# EAGLE design Hot_tub_PoE_RS485_Arduino (EAGLE 6.4)
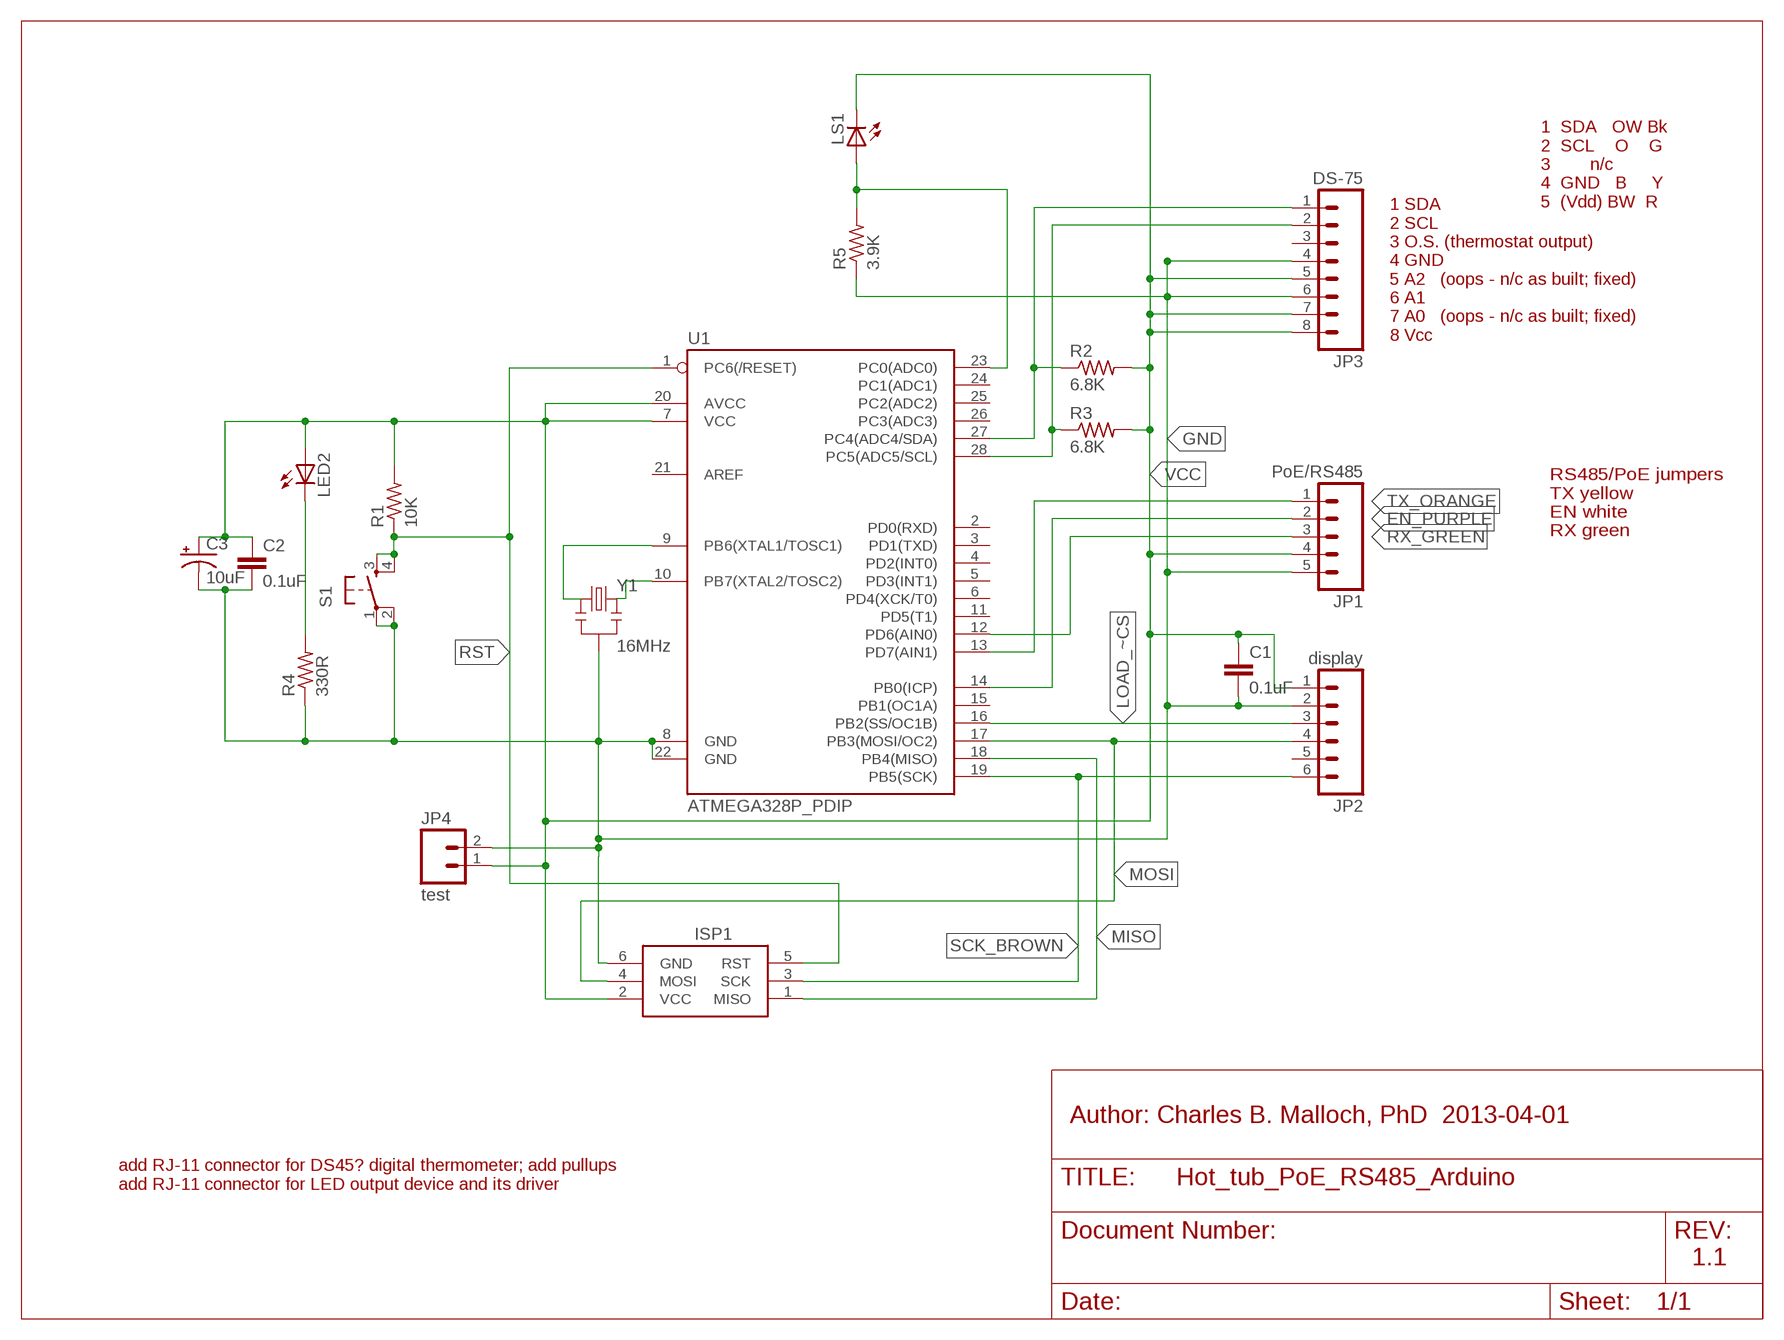
[diagram p0: schematic, sheet 1]

## Parts
C1  0.1uF  CAPPTH  [CAP-PTH-SMALL]
C2  0.1uF  CAPPTH  [CAP-PTH-SMALL]
C3  10uF  CAP_POLPTH2  [CPOL-RADIAL-10UF-25V]
ISP1  AVRISP-6  [AVRISP]
JP1  PoE/RS485  M05LOCK_LONGPADS  [1X05_LOCK_LONGPADS]
JP2  display  M06LOCK_LONGPADS  [1X06_LOCK_LONGPADS]
JP3  DS-75  M08LOCK_LONGPADS  [1X08_LOCK_LONGPADS]
JP4  test  M02LOCK_LONGPADS  [1X02_LOCK_LONGPADS]
LED2  LED5MM  [LED5MM]
LS1  LED5MM  [LED5MM]
R1  10K  R-US_0204/5  [0204/5]
R2  6.8K  R-US_0207/10  [0207/10]
R3  6.8K  R-US_0207/10  [0207/10]
R4  330R  R-US_0207/10  [0207/10]
R5  3.9K  R-US_0207/10  [0207/10]
S1  TAC_SWITCHPTH  [TACTILE-PTH]
U1  ATMEGA328P_PDIP  [DIL28-3]
Y1  16MHz  RESONATORPTH  [RESONATOR-PTH]

## Nets
EN_PURPLE: JP1.2 U1.14(PB0(ICP))
GND: C1.2 C2.2 C3.2(-) ISP1.6(GND) JP1.5 JP2.2 JP3.4 JP3.6 JP4.2 R4.1 R5.1 S1.1 S1.2 U1.8(GND) U1.22(GND) Y1.2
LOAD_~CS: JP2.3 U1.16(PB2(SS/OC1B))
MISO: ISP1.1(MISO) U1.18(PB4(MISO))
MOSI: ISP1.4(MOSI) JP2.4 U1.17(PB3(MOSI/OC2))
N$1: JP3.1 R2.1 U1.27(PC4(ADC4/SDA))
N$2: LED2.K(C) R4.2
N$3: LS1.A R5.2 U1.23(PC0(ADC0))
N$5: U1.10(PB7(XTAL2/TOSC2)) Y1.3
N$6: JP3.2 R3.1 U1.28(PC5(ADC5/SCL))
N$7: U1.9(PB6(XTAL1/TOSC1)) Y1.1
RST: ISP1.5(RST) R1.1 S1.3 S1.4 U1.1(PC6(/RESET))
RX_GREEN: JP1.3 U1.12(PD6(AIN0))
SCK_BROWN: ISP1.3(SCK) JP2.6 U1.19(PB5(SCK))
TX_ORANGE: JP1.1 U1.13(PD7(AIN1))
VCC: C1.1 C2.1 C3.1(+) ISP1.2(VCC) JP1.4 JP2.1 JP3.5 JP3.7 JP3.8 JP4.1 LED2.A LS1.K(C) R1.2 R2.2 R3.2 U1.7(VCC) U1.20(AVCC)
Unconnected: JP2.5 JP3.3 U1.2(PD0(RXD)) U1.3(PD1(TXD)) U1.4(PD2(INT0)) U1.5(PD3(INT1)) U1.6(PD4(XCK/T0)) U1.11(PD5(T1)) U1.15(PB1(OC1A)) U1.21(AREF) U1.24(PC1(ADC1)) U1.25(PC2(ADC2)) U1.26(PC3(ADC3))

## Notes on the sheet
- 1  SDA   OW Bk
  2  SCL    O    G
  3        n/c
  4  GND   B     Y
  5  (Vdd) BW  R
- 1 SDA
  2 SCL
  3 O.S. (thermostat output)
  4 GND
  5 A2   (oops - n/c as built; fixed)
  6 A1
  7 A0   (oops - n/c as built; fixed)
  8 Vcc
- RS485/PoE jumpers
  TX yellow
  EN white
  RX green
- Author: Charles B. Malloch, PhD  2013-04-01
- add RJ-11 connector for DS45? digital thermometer; add pullups
  add RJ-11 connector for LED output device and its driver
- 1.1

## Library data of the parts
C1 C2 = SparkFun-Passives:CAP: Capacitor Standard 0603 ceramic capacitor, and 0.1" leaded capacitor.
C3 = SparkFun-Passives:CAP_POL: Capacitor Polarized These are standard SMD and PTH capacitors. Normally 10uF, 47uF, and 100uF in electrolytic and tantalum varieties. Always verify the external diameter of the through hole cap, it varies with capacity, voltage, and manufacturer. The EIA devices should be standard.
ISP1 = adafruit:AVRISP: AVR ISP HEADER Standard 6 pin header for AVR programming
JP1 = SparkFun-Connectors:M05: Header 5 Standard 5-pin 0.1" header. Use with straight break away headers (SKU : PRT-00116), right angle break away headers (PRT-00553), swiss pins (PRT-00743), machine pins (PRT-00117), and female headers (PRT-00115). Molex polarized connector foot print use with SKU : PRT-08230 with associated crimp pins and housings.
JP2 = SparkFun-Connectors:M06: Header 6 Standard 6-pin 0.1" header. Use with straight break away headers (SKU : PRT-00116), right angle break away headers (PRT-00553), swiss pins (PRT-00743), machine pins (PRT-00117), and female headers (PRT-00115). Molex polarized connector foot print use with SKU : PRT-08094 with associated crimp pins and housings. NOTES ON THE VARIANTS LOCK and LOCK_LONGPADS... This footprint was designed to help hold the alignment of a through-hole component (i.e. 6-pin header) while soldering it into place. You may notice that each hole has been shifted either up or down by 0.005 of an inch from it's more standard position (which is a perfectly straight line). This slight alteration caused the pins (the squares in the middle) to touch the edges of the holes. Because they are alternating, it causes a "brace" to hold the component in place. 0.005 has proven to be the perfect amount of "off-center" position when using our standard breakaway headers. Although looks a little odd when you look at the bare footprint, once you have a header in there, the alteration is very hard to notice. Also, if you push a header all the way into place, it is covered up entirely on the bottom side. This idea of altering the position of holes to aid alignment will be further integrated into the Sparkfun Library for other footprints. It can help hold any component with 3 or more connection pins.
JP3 = SparkFun-Connectors:M08: Header 8 Standard 8-pin 0.1" header. Use with straight break away headers (SKU : PRT-00116), right angle break away headers (PRT-00553), swiss pins (PRT-00743), machine pins (PRT-00117), and female headers (PRT-00115).
JP4 = SparkFun-Connectors:M02: Header 2 Standard 2-pin 0.1" header. Use with straight break away headers (SKU : PRT-00116), right angle break away headers (PRT-00553), swiss pins (PRT-00743), machine pins (PRT-00117), and female headers (PRT-00115). Molex polarized connector foot print use with SKU : PRT-08233 with associated crimp pins and housings.
LED2 LS1 = SparkFun-LED:LED: LEDs Standard schematic elements and footprints for 5mm, 3mm, 1206, and 0603 sized LEDs. 5mm - Spark Fun Electronics SKU : COM-00529 (and others)
R1 = adafruit:R-US_: RESISTOR, American symbol
R2-R5 = resistor:R-US_: RESISTOR, American symbol
S1 = SparkFun-Electromechanical:TAC_SWITCH: Momentary Switch Button commonly used for reset or general input. Spark Fun Electronics SKU : COM-00097 SMT- SWCH-08247
U1 = SparkFun-DigitalIC:ATMEGA328P_PDIP: uC used in the Arduino 32kb flash, 1k EEPROM, 2k SRAM This is the through-hole version of this chip.
Y1 = SparkFun-FreqCtrl:RESONATOR: Resonator Small SMD resonator. Used, eg, on the Arduino Pro/ Pro Mini boards. 8MHz- XTAL-08895 16MHz- XTAL-08900

## Board
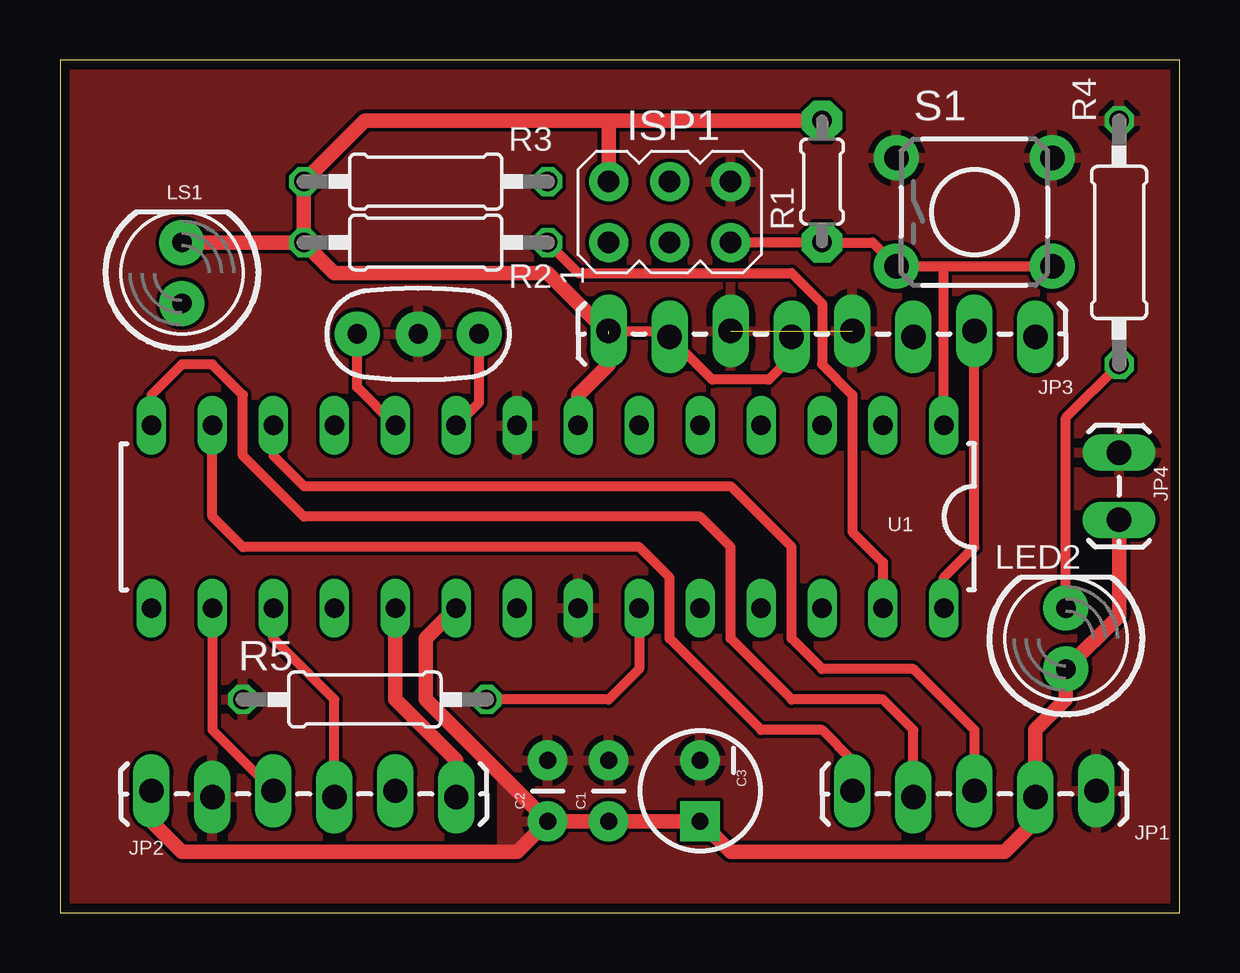
[diagram p1: board, top side]
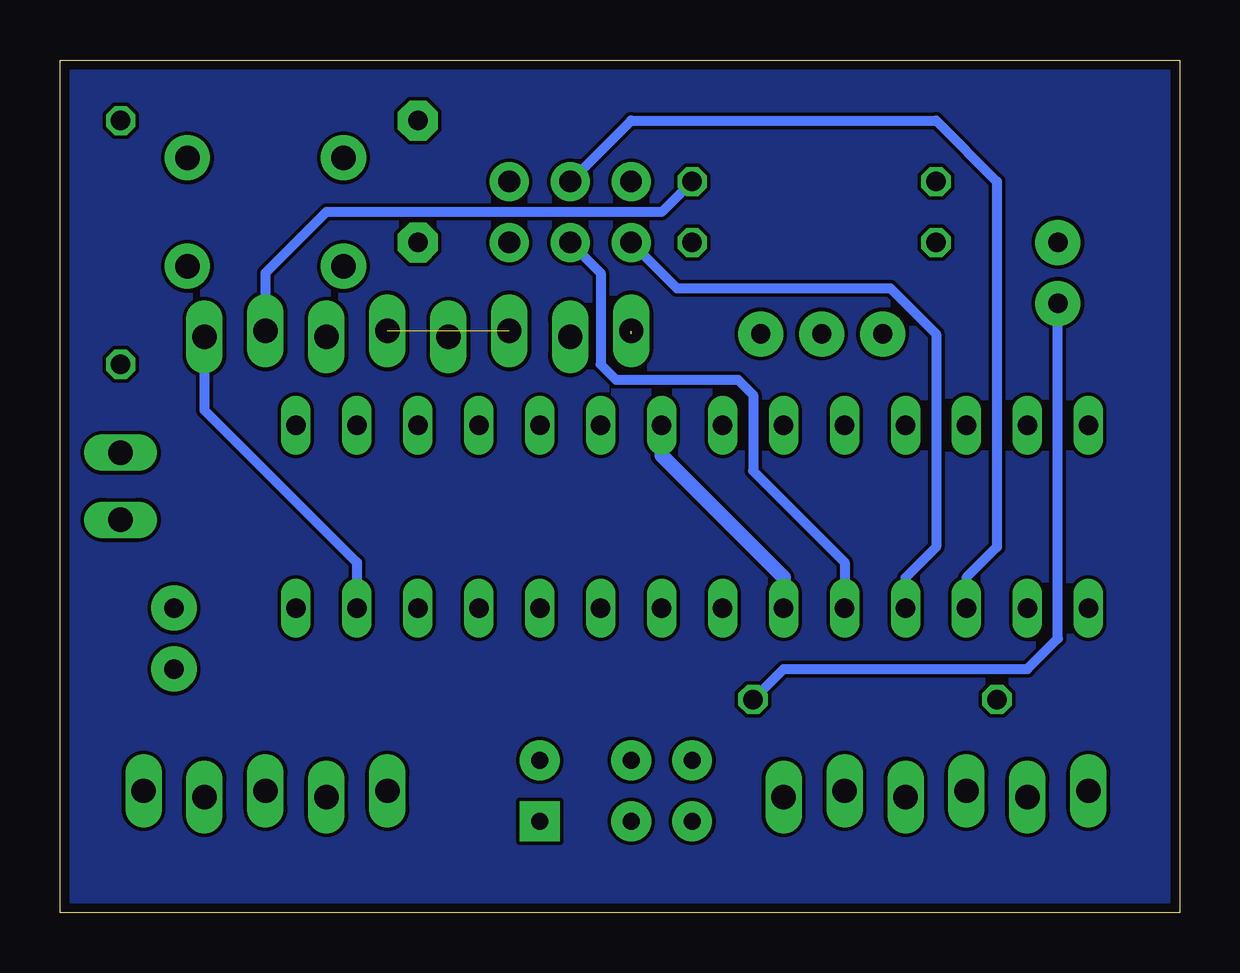
[diagram p2: board, bottom side, seen from below]

Size 46.66 x 35.55 mm. Coordinates in mm from the lower left corner, seen from the top.
Outline: 0,0 46.66,0 46.66,35.55 0,35.55 0,0
Copper layers (1*16): Top 0.0356mm / dielectric 1.5011mm / Bottom 0.0356mm
Design rules "LaenPCBOrder": minimum track width 6mil, minimum drill 13mil, track to track 6mil, track to pad 6mil, pad to pad 6mil, via to via 6mil, smd to smd 6mil, copper to edge 15mil, drill to drill 6mil, minimum pad ring 7mil, minimum via ring 7mil, stop-mask expansion 4mil, vias tented up to drill 0mil, thermal gap 10mil

### Footprints (pad centres in the part's own frame; a part is rotated, then mirrored left to right if it is on the bottom)
CAP-PTH-SMALL = drill 0.7 pad 1.651: 1 0,0; 2 2.54,0
CPOL-RADIAL-10UF-25V = drill 0.7 pad 1.651 square: 1 1.27,0 | drill 0.7 pad 1.651: 2 -1.27,0
AVRISP = drill 0.9 pad 1.626: 1 -1.27,2.54; 2 1.27,2.54; 3 -1.27,0; 4 1.27,0; 5 -1.27,-2.54; 6 1.27,-2.54
1X05_LOCK_LONGPADS = drill 1.016 long: 1 0,0; 2 2.54,-0.254; 3 5.08,0; 4 7.62,-0.254; 5 10.16,0
1X06_LOCK_LONGPADS = drill 1.016 long: 1 0,0; 2 2.54,-0.254; 3 5.08,0; 4 7.62,-0.254; 5 10.16,0; 6 12.7,-0.254
1X08_LOCK_LONGPADS = drill 1.016 long: 1 0,0.127; 2 2.54,-0.127; 3 5.08,0.127; 4 7.62,-0.127; 5 10.16,0.127; 6 12.7,-0.127; 7 15.24,0.127; 8 17.78,-0.127
1X02_LOCK_LONGPADS = drill 1.016 long: 1 -0.127,0; 2 2.667,0
LED5MM = drill 0.813 pad 1.88: A -1.27,0; K 1.27,0
0204/5 = drill 0.813 pad 1.676 octagon: 1 -2.54,0; 2 2.54,0
0207/10 = drill 0.813 octagon: 1 -5.08,0; 2 5.08,0
TACTILE-PTH = drill 1.016 pad 1.88: 1 -3.251,2.261; 2 3.251,2.261; 3 -3.251,-2.261; 4 3.251,-2.261
DIL28-3 = drill 0.813 long: 1 -16.51,-3.81; 2 -13.97,-3.81; 3 -11.43,-3.81; 4 -8.89,-3.81; 5 -6.35,-3.81; 6 -3.81,-3.81; 7 -1.27,-3.81; 8 1.27,-3.81; 9 3.81,-3.81; 10 6.35,-3.81; 11 8.89,-3.81; 12 11.43,-3.81; 13 13.97,-3.81; 14 16.51,-3.81; 15 16.51,3.81; 16 13.97,3.81; 17 11.43,3.81; 18 8.89,3.81; 19 6.35,3.81; 20 3.81,3.81; 21 1.27,3.81; 22 -1.27,3.81; 23 -3.81,3.81; 24 -6.35,3.81; 25 -8.89,3.81; 26 -11.43,3.81; 27 -13.97,3.81; 28 -16.51,3.81
RESONATOR-PTH = drill 0.8 pad 1.88: 1 -2.54,0; 2 0,0; 3 2.54,0

### Placement (x,y rotation side)
C1  22.86,3.81 90 top
C2  20.32,3.81 90 top
C3  26.67,5.08 270 top
ISP1  25.4,29.21 90 top
JP1  33.02,5.08 0 top
JP2  3.81,5.08 0 top
JP3  40.64,24.13 180 top
JP4  44.13,16.51 90 top
LED2  41.91,11.43 90 top
LS1  5.08,26.67 90 top
R1  31.75,30.48 90 top
R2  15.24,27.94 180 top
R3  15.24,30.48 180 top
R4  44.13,27.94 270 top
R5  12.7,8.89 0 top
S1  38.1,29.21 0 top
U1  20.32,16.51 180 top
Y1  14.92,24.13 180 top

### Tracks (layer width: path | path; a pad name or v marks a point on that pad's centre or on a via)
EN_PURPLE
  Top 0.406: JP1.2 35.56,7.62 34.29,8.89 30.48,8.89 27.94,11.43 27.94,15.24 26.67,16.51 10.16,16.51 7.62,19.05 7.62,21.59 6.35,22.86 5.08,22.86 3.81,21.59 U1.14
GND  (1 unrouted)
  pour Top: 0,0 0,35.56 46.99,35.56 46.99,0
LOAD_~CS
  Top 0.406: U1.16 6.35,7.62 JP2.3
MISO
  Bottom 0.406: ISP1.1 20.95,26.04 12.06,26.04 10.16,24.13 10.16,15.24 11.43,13.97 U1.18
MOSI
  Top 0.406: JP2.4 11.43,8.89 8.89,11.43 U1.17
  Bottom 0.406: ISP1.4 22.86,33.02 10.16,33.02 7.62,30.48 7.62,15.24 8.89,13.97 U1.17
N$1
  Top 0.406: R2.1 21.59,26.67 30.48,26.67 31.75,25.4 31.75,22.86 33.02,21.59 33.02,15.88 34.29,14.61 U1.27
  Bottom 0.406: JP3.1 40.64,20.95 34.29,14.61 U1.27
N$2
  Top 0.406: LED2.K 41.91,20.64 R4.2
N$3
  Top 0.406: U1.23 24.13,10.16 22.86,8.89 R5.2
  Bottom 0.406: R5.2 16.51,10.16 6.35,10.16 5.08,11.43 LS1.A
N$5
  Top 0.406: U1.10 12.38,21.91 Y1.3
N$6
  Top 0.406: U1.28 36.83,13.97 38.1,15.24 JP3.2
  Bottom 0.406: R3.1 21.59,29.21 35.56,29.21 38.1,26.67 JP3.2
N$7
  Top 0.406: U1.9 17.46,21.27 Y1.1
N$8
  pour Bottom: 0,0 0,35.56 46.99,35.56 46.99,0
RST
  Top 0.406: ISP1.5 R1.1 33.86,27.94 S1.3 36.83,26.95 | 36.83,26.95 S1.4 | U1.1 36.83,26.95
RX_GREEN
  Top 0.406: U1.12 8.89,19.05 10.16,17.78 27.94,17.78 30.48,15.24 30.48,11.43 31.75,10.16 35.56,10.16 38.1,7.62 JP1.3
SCK_BROWN
  Top 0.61: JP2.6 16.51,6.35 13.97,8.89 U1.19
  Bottom 0.406: ISP1.3 24.13,26.67 24.13,22.86 23.5,22.23 18.41,22.23 17.78,21.59 17.78,18.41 13.97,14.61 U1.19 13.97,12.06
TX_ORANGE
  Top 0.406: JP1.1 33.02,6.35 31.75,7.62 29.21,7.62 25.4,11.43 25.4,13.97 24.13,15.24 7.62,15.24 6.35,16.51 U1.13
VCC  (1 unrouted)
  Top 0.406: JP3.5 30.48,23.18 29.53,22.23 27.18,22.23 JP3.7 25.15,24.26 JP3.8
  Top 0.61: C2.1 C1.1 C3.1 27.94,2.54 39.37,2.54 40.64,3.81 JP1.4 40.64,7.62 41.91,8.89 LED2.A 44.13,12.38 JP4.1 | U1.20 15.24,11.43 15.24,8.89 C2.1 | U1.7 21.59,21.59 22.86,22.86 22.86,24.13 20.32,26.67 11.43,26.67 R2.2 | R2.2 R3.2 12.7,33.02 22.86,33.02 | JP2.1 3.81,3.81 5.08,2.54 19.05,2.54 C2.1 | R1.2 22.86,33.02 | ISP1.2 22.86,33.02 | R2.2 LS1.K
  Bottom 0.61: U1.20 16.51,13.97 21.59,19.05 U1.7
  pour Top: 20.32,3.81 18.41,5.71 18.41,2.54 19.05,2.54

### Text on the board
tValues: light / sensor | GND | +5VDC | Hot Tub Monitor v1.1 / cbm electronics 2013 | VCC | GND | ~CS | MOSI | NC | SCK | TX | EN | RX | VCC | GND